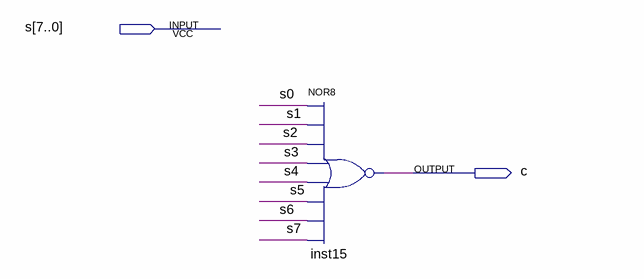
[diagram p0: schematic sheet]
// Quartus schematic zero_check.bdf as structural Verilog: 1 symbols, 2 pins
module zero_check (
  input  [7:0] s,
  output c
);

  nor inst15 (c, s[0], s[1], s[2], s[3], s[4], s[5], s[6], s[7]);
endmodule
